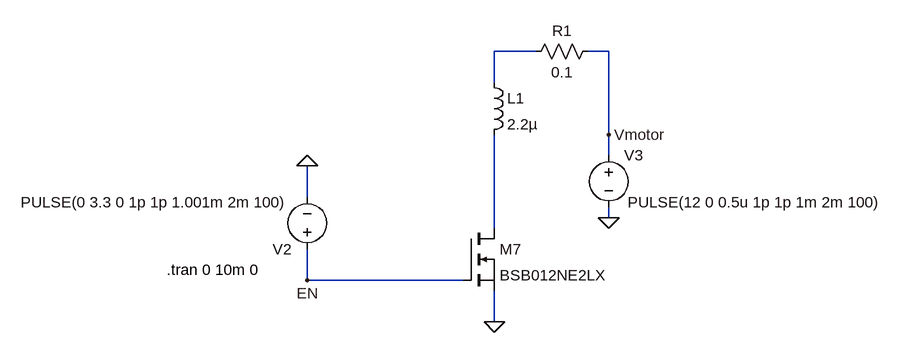
[diagram p0: schematic MovementDet-FET-Protection.asc]
MovementDet-FET-Protection.asc, the LTspice schematic file:
Version 4
SHEET 1 2120 1876
WIRE 416 832 352 832
WIRE 528 832 496 832
WIRE 352 880 352 832
WIRE 528 960 528 832
WIRE 528 992 528 960
WIRE 64 1056 64 1008
WIRE 528 1088 528 1072
WIRE 352 1104 352 960
WIRE 64 1184 64 1136
WIRE 304 1184 64 1184
WIRE 352 1248 352 1200
FLAG 352 1248 0
FLAG 528 1088 0
FLAG 528 960 Vmotor
FLAG 64 1008 0
FLAG 64 1184 EN
SYMBOL nmos 304 1104 R0
SYMATTR InstName M7
SYMATTR Value BSB012NE2LX
SYMBOL voltage 64 1152 R180
WINDOW 3 29 88 Left 2
WINDOW 123 0 0 Left 0
WINDOW 39 0 0 Left 0
SYMATTR Value PULSE(0 3.3 0 1p 1p 1.001m 2m 100)
SYMATTR InstName V2
SYMBOL voltage 528 976 R0
WINDOW 3 29 88 Left 2
WINDOW 123 0 0 Left 0
WINDOW 39 24 44 Left 2
SYMATTR Value PULSE(12 0 0.5u 1p 1p 1m 2m 100)
SYMATTR InstName V3
SYMBOL ind 336 864 R0
SYMATTR InstName L1
SYMATTR Value 2.2µ
SYMBOL res 512 816 R90
WINDOW 0 0 56 VBottom 2
WINDOW 3 32 56 VTop 2
SYMATTR InstName R1
SYMATTR Value 0.1
TEXT -152 1168 Left 2 !.tran 0 10m 0

The netlist it stands for:
* MovementDet-FET-Protection.asc
M7 N002 EN 0 0 BSB012NE2LX
V2 EN 0 PULSE(0 3.3 0 1p 1p 1.001m 2m 100)
V3 Vmotor 0 PULSE(12 0 0.5u 1p 1p 1m 2m 100)
L1 N001 N002 2.2µ
R1 Vmotor N001 0.1
.model NMOS NMOS
.model PMOS PMOS
.lib standard.mos
.tran 0 10m 0
.backanno
.end